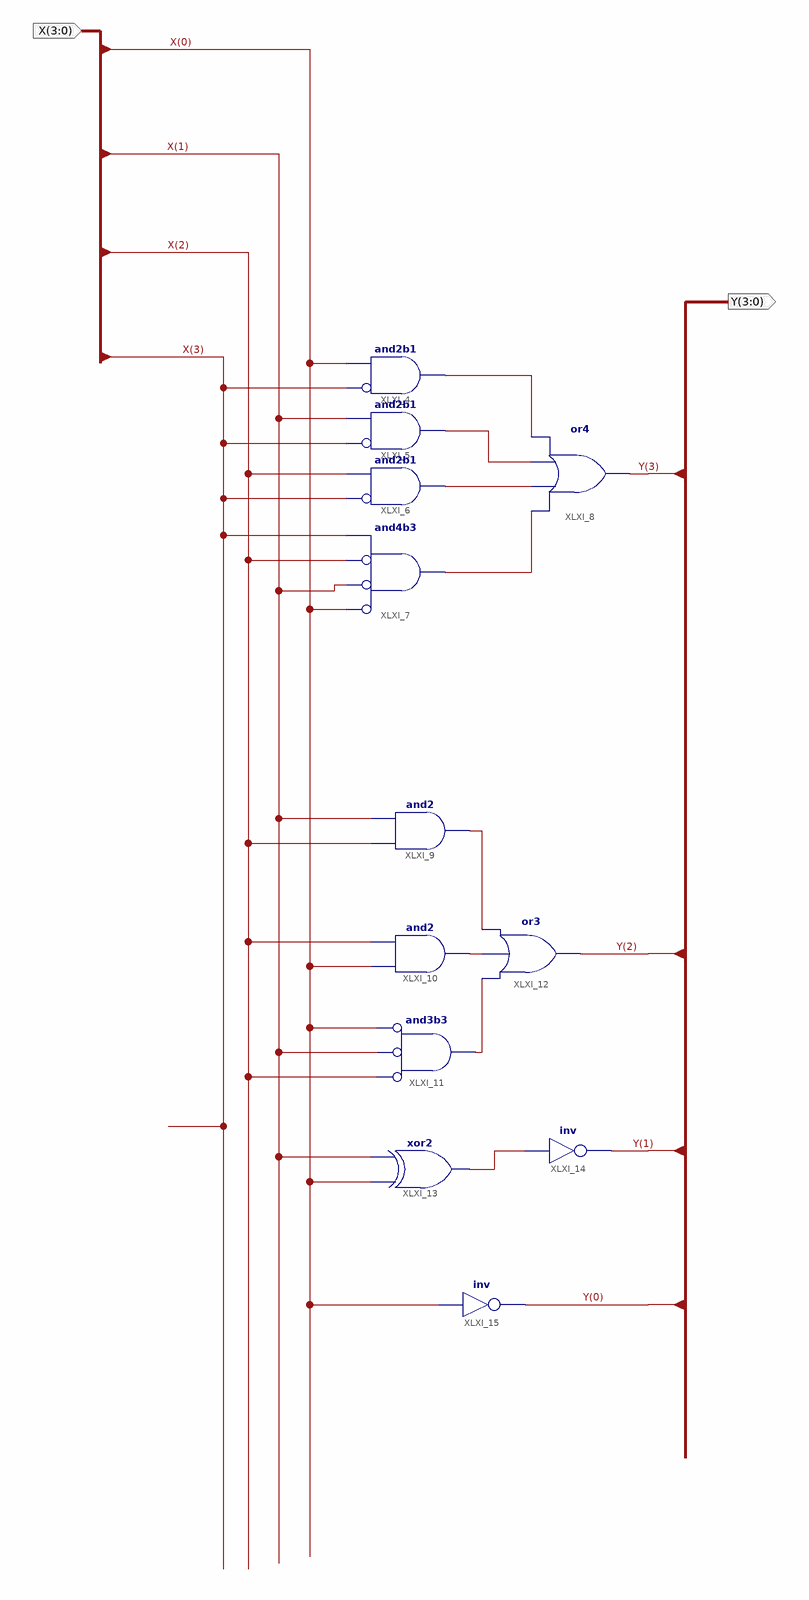
[diagram p0: schematic sheet 1]
// Xilinx ISE schematic Schematlab1.sch (xc9500xl) as structural Verilog: 12 symbols, 2 ports
module Schematlab1 (
  input  [3:0] X,
  output [3:0] Y
);

  wire XLXN_24, XLXN_25, XLXN_26, XLXN_27, XLXN_35, XLXN_36, XLXN_37, XLXN_42;

  and XLXI_4 (XLXN_24, ~X[3], X[0]);  // and2b1
  and XLXI_5 (XLXN_25, ~X[3], X[1]);  // and2b1
  and XLXI_6 (XLXN_26, ~X[3], X[2]);  // and2b1
  and XLXI_7 (XLXN_27, ~X[0], ~X[1], ~X[2], X[3]);  // and4b3
  or XLXI_8 (Y[3], XLXN_27, XLXN_26, XLXN_25, XLXN_24);
  and XLXI_9 (XLXN_35, X[2], X[1]);
  and XLXI_10 (XLXN_36, X[0], X[2]);
  and XLXI_11 (XLXN_37, ~X[2], ~X[1], ~X[0]);  // and3b3
  or XLXI_12 (Y[2], XLXN_37, XLXN_36, XLXN_35);
  xor XLXI_13 (XLXN_42, X[0], X[1]);
  not XLXI_14 (Y[1], XLXN_42);
  not XLXI_15 (Y[0], X[0]);
endmodule
